# EAGLE design SchematicV0 (EAGLE 7.6.0)
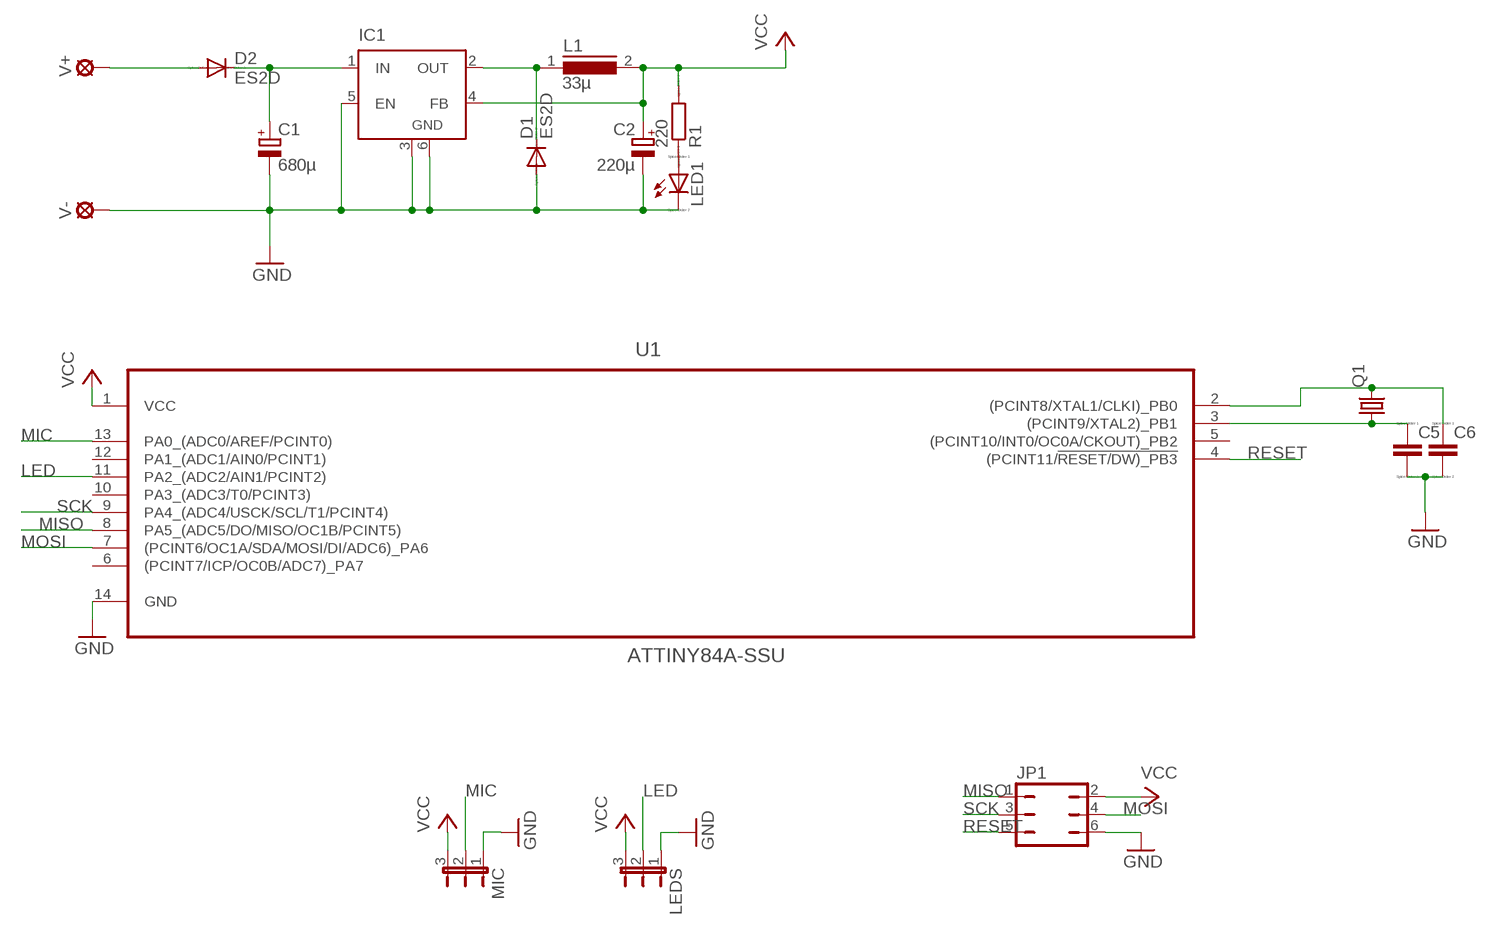
[diagram p0: schematic, sheet 1]

## Parts
C1  680µ  CPOL-EU140CLH-1010  [140CLH-1010]
C2  220µ  CPOL-EU140CLH-1010  [140CLH-1010]
C5  CC1005  [C1005]
C6  CC1005  [C1005]
D1  ES2D  [SMB]
D2  ES2D  [SMB]
IC1  LM2596S  [TO263-5]
JP1  JP3Q  [JP3Q]
L1  33µ  DR125  [DR125]
LED1  LED_E  [LED_1206]
LEDS  JP2E  [JP2]
MIC  JP2E  [JP2]
Q1  CRYSTALHC49S  [HC49/S]
R1  220  R  [R0805]
U1  ATTINY84A-SSU  [SOIC127P600X175-14N]
V+  SE14  [SE14]
V-  SE14  [SE14]

## Nets
GND: C1.- C2.- C5.2 C6.2 D1.A IC1.3(GND) IC1.5(EN) IC1.6(GND) JP1.6 LED1.C LEDS.1 MIC.1 U1.14(GND) V-.MP
LED: LEDS.2 U1.11(PA2_(ADC2/AIN1/PCINT2))
MIC: MIC.2 U1.13(PA0_(ADC0/AREF/PCINT0))
MISO: JP1.1 U1.8(PA5_(ADC5/DO/MISO/OC1B/PCINT5))
MOSI: JP1.4 U1.7((PCINT6/OC1A/SDA/MOSI/DI/ADC6)_PA6)
N$1: C1.+ D2.C IC1.1(IN)
N$2: D2.A V+.MP
N$3: C5.1 Q1.1 U1.3((PCINT9/XTAL2)_PB1)
N$4: C6.1 Q1.2 U1.2((PCINT8/XTAL1/CLKI)_PB0)
N$5: D1.C IC1.2(OUT) L1.1
N$7: LED1.A R1.1
RESET: JP1.5 U1.4((PCINT11/!RESET/DW)_PB3)
SCK: JP1.3 U1.9(PA4_(ADC4/USCK/SCL/T1/PCINT4))
VCC: C2.+ IC1.4(FB) JP1.2 L1.2 LEDS.3 MIC.3 R1.2 U1.1(VCC)
Unconnected: U1.5((PCINT10/INT0/OC0A/CKOUT)_PB2) U1.6((PCINT7/ICP/OC0B/ADC7)_PA7) U1.10(PA3_(ADC3/T0/PCINT3)) U1.12(PA1_(ADC1/AIN0/PCINT1))

## Library data of the parts
C1 C2 = rcl:CPOL-EU: POLARIZED CAPACITOR, European symbol
C5 C6 = eagle-ltspice:C: CAPACITOR, European symbol; SPICEMODEL: NONE; SPICEPREFIX: C
D1 D2 = diode:ES2D: DIODE super fast rectifier, 2 A
IC1 = linear:LM2596S: STEP-DOWN VOLTAGE REGULATOR
JP1 = jumper:JP3Q: JUMPER
L1 = inductors:DR125: High Power Density, High Efficiency, Shielded Inductors Source: coiltronics_dr_series.pdf
LED1 = eagle-ltspice:LED_E: LED Source: http://www.osram.convergy.de Source: www.luxeon.com Source: www.kingbright.com; SPICEMODEL: NONE; SPICEPREFIX: D; SPICETYPE: diode
LEDS MIC = jumper:JP2E: JUMPER
Q1 = crystal:CRYSTAL: CRYSTAL; OC_FARNELL: 1667008; OC_NEWARK: unknown
R1 = eagle-ltspice:R: RESISTOR, European symbol; SPICEMODEL: NONE; SPICEPREFIX: R
U1 = atmel Tiny84A-SSU:ATTINY84A-SSU: IC, 8BIT MCU, AVR Tiny, 20MHZ, SOIC-14; MPN: ATTINY84A-SSU; OC_FARNELL: Unknown; OC_NEWARK: 68T3793; PACKAGE: SOIC-14; SUPPLIER: ATMEL
V+ V- = solpad:SE14: SOLDER PAD E1553, drill 1,4mm, distributor Buerklin, 07F820

## Board
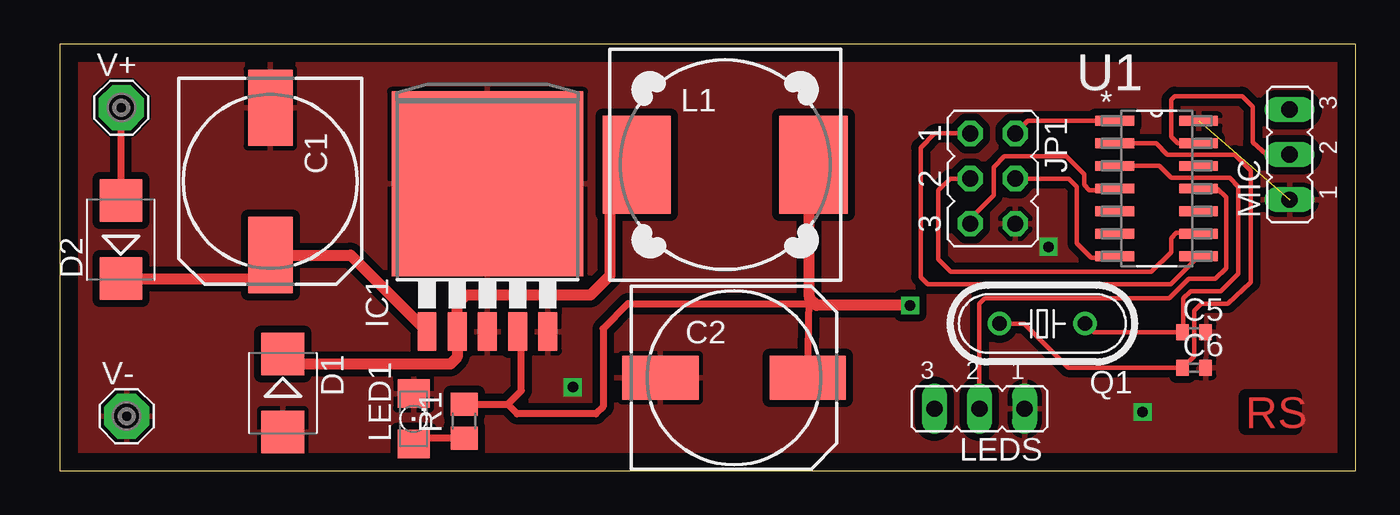
[diagram p1: board, top side]
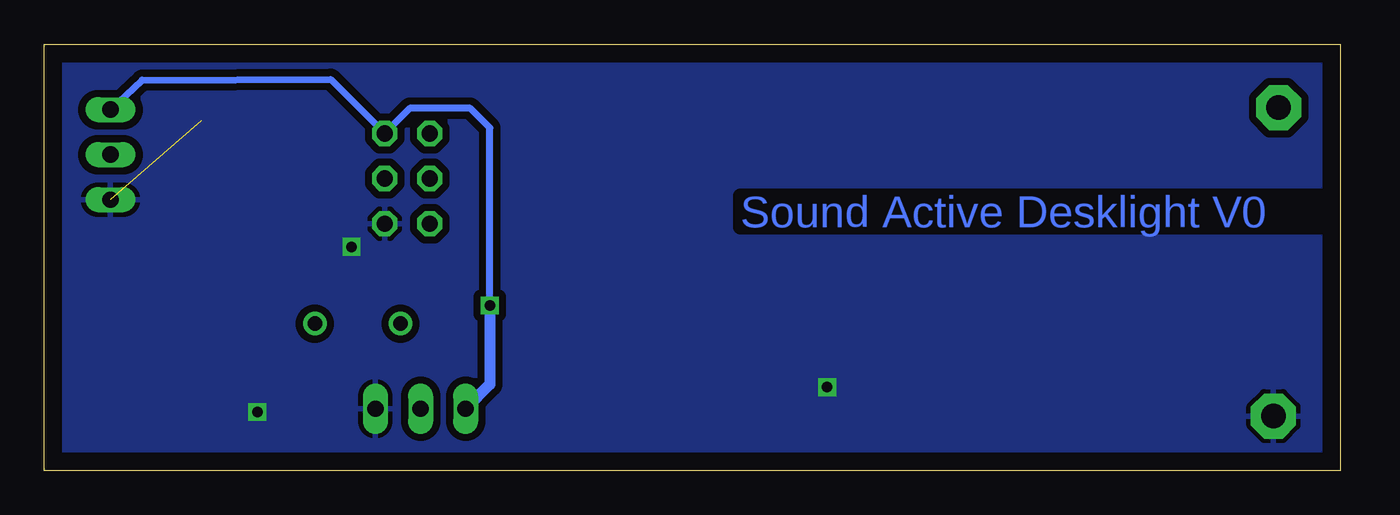
[diagram p2: board, bottom side, seen from below]

Size 73 x 24.01 mm. Coordinates in mm from the lower left corner, seen from the top.
Outline: 0,0 73,0 73,24.01 0,24.01 0,0
Copper layers (1*16): Top 0.035mm / dielectric 1.5mm / Bottom 0.035mm
Design rules "default": minimum track width 10mil, minimum drill 24mil, track to track 8mil, track to pad 8mil, pad to pad 8mil, via to via 8mil, smd to smd 8mil, copper to edge 40mil, drill to drill 8mil, minimum pad ring 10mil, minimum via ring 8mil, stop-mask expansion 4mil, vias tented up to drill 0mil, thermal gap 10mil

### Footprints (pad centres in the part's own frame; a part is rotated, then mirrored left to right if it is on the bottom)
140CLH-1010 = smd 4.3 x 2.5: + 4.15,0; - -4.15,0
C1005 = smd 0.7 x 0.9: 1 -0.65,0; 2 0.65,0
SMB = smd 2.4 x 2.4: A 2.2,0; C -2.2,0
TO263-5 = smd 1.067 x 2.159: 1 -3.404,-5.791; 2 -1.702,-5.791; 3 0,-5.791; 4 1.702,-5.791; 5 3.404,-5.791 | smd 10.8 x 10.41: 6 0,2.54
JP3Q = drill 0.914 octagon: 1 -2.54,-1.27; 2 -2.54,1.27; 3 0,-1.27; 4 0,1.27; 5 2.54,-1.27; 6 2.54,1.27
DR125 = smd 3.85 x 5.5: 1 -4.975,0; 2 4.975,0
LED_1206 = smd 1.6 x 1.803: A -1.422,0; C 1.422,0
JP2 = drill 0.914 long: 1 -2.54,0; 2 0,0; 3 2.54,0
HC49/S = drill 0.813: 1 -2.413,0; 2 2.413,0
R0805 = smd 1.3 x 1.5: 1 -0.95,0; 2 0.95,0
SOIC127P600X175-14N = smd 2.184 x 0.559: 1 -2.362,3.81; 2 -2.362,2.54; 3 -2.362,1.27; 4 -2.362,0; 5 -2.362,-1.27; 6 -2.362,-2.54; 7 -2.362,-3.81; 8 2.362,-3.81; 9 2.362,-2.54; 10 2.362,-1.27; 11 2.362,0; 12 2.362,1.27; 13 2.362,2.54; 14 2.362,3.81
SE14 = drill 1.397 pad 2.54 octagon: MP 0,0

### Placement (x,y rotation side)
C1  11.86,16.29 270 top
C2  37.98,5.23 0 top
C5  63.9,7.8 0 top
C6  63.9,5.8 0 top
D1  12.56,4.37 270 top
D2  3.44,13.01 90 top
IC1  24.09,13.62 0 top
JP1  52.56,16.45 270 top
L1  37.48,17.23 0 top
LED1  19.93,2.91 90 top
LEDS  51.81,3.48 180 top
MIC  69.28,17.8 90 top
Q1  55.35,8.28 180 top
R1  22.78,2.78 90 top
U1  61.79,15.89 0 top
V+  3.47,20.45 0 top
V-  3.76,3.07 0 top

### Tracks (layer width: path | path; a pad name or v marks a point on that pad's centre or on a via)
GND  (via drill 0.6, 0.6 pad 0.3)  (1 unrouted)
  Top 0.406: 24.09,20.44 IC1.6
  other vias: 28.9,4.7 61,3.3 55.7,12.6
  pour Top (isolate 0.406): 0,0 72.9,0 72.9,24.1 0,24
  pour Bottom (isolate 0.406): 0,0 72.9,0 72.9,24.1 0,24
LED
  Top 0.254: U1.11 65.21,15.89 65.7,15.4 65.7,11.4 65.1,10.8 63.6,10.8 62.5,9.7 52.1,9.7 51.8,9.4 51.8,3.59 LEDS.2
MIC
  Top 0.254: U1.13 62.97,18.43 62.6,18.8 62.6,20.9 62.8,21.1 66.6,21.1 67.2,20.5 67.2,18.5 68,17.78 MIC.2
MISO
  Top 0.254: JP1.1 49.29,18.99 48.5,18.2 48.5,10.9 48.9,10.5 62.57,10.5 U1.8
MOSI
  Top 0.254: JP1.4 56.85,16.45 57.3,16 57.3,12.8 58.1,12 59.35,12 U1.7
N$1
  Top 0.406: 11.86,10.81 C1.+
  Top 0.61: D2.C 11.86,10.81 | C1.+ 16.38,12.14 IC1.1
N$2
  Top 0.406: V+.MP 3.44,20.45 D2.A
N$3
  Top 0.254: U1.3 61.94,17.16 62.6,16.5 65.9,16.5 66.4,16 66.4,11.1 65.4,10.1 63.7,10.1 63.3,9.7 63.3,7.85 C5.1 58.24,7.8 Q1.1
N$4
  Top 0.254: Q1.2 54.32,8.28 56.8,5.8 C6.1 63.9,6.45 63.9,9 64.3,9.4 65.8,9.4 67.1,10.6 67.1,16.9 66.2,17.8 62.4,17.8 61.77,18.43 U1.2
N$5
  Top 0.406: 31,14.43 L1.1 | 13.13,6 D1.C
  Top 0.61: 31,14.43 31,11 29.9,9.9 22.9,9.9 22.39,9.39 IC1.2 22.39,6.39 22,6 13.13,6
N$7
  Top 0.406: R1.1 20.27,1.83 LED1.A
RESET
  Top 0.254: JP1.5 51.29,14.19 52.6,15.5 52.6,17.1 53.2,17.7 56.7,17.7 57.7,16.7 57.7,16.1 58,15.8 59.34,15.8 U1.4
SCK
  Top 0.254: JP1.3 50.15,16.45 49.5,15.8 49.5,11.9 50.2,11.2 61.5,11.2 62.6,12.3 62.6,13.1 62.9,13.4 64.1,13.4 U1.9
VCC  (via drill 0.6 pad 0.3)
  Top 0.254: U1.1 54.54,19.7 JP1.2
  Top 0.406: R1.2 25.23,3.73 | 25.23,3.73 26,4.5 26,7.62 IC1.4 26,8.04 | 59.53,19.8 U1.1 | C2.+ 42.23,9.7 | 42.23,9.7 42.23,9.8 | 42.23,17 L1.2 | 42.23,9.7 42.23,9.4 32,9.4 30.6,8 30.6,3.6 30.2,3.2 25.76,3.2 25.23,3.73
  Top 0.61: 42.23,9.8 42.23,17 | v47.9,9.3 42.63,9.3 42.23,9.7
  Bottom 0.406: v47.9,9.3 47.9,19.3 49,20.4 52.42,20.4 JP1.2 56.88,22.04 67.5,22 69.26,20.34 MIC.3
  Bottom 0.61: v47.9,9.3 47.9,4.85 LEDS.3

### Text on the board
Top: RS
Bottom: Sound Active Desklight V0